# Altium schematic sheet buck_reg_old.SchDoc
size A3; SheetNumber: 2; SheetTotal: 3
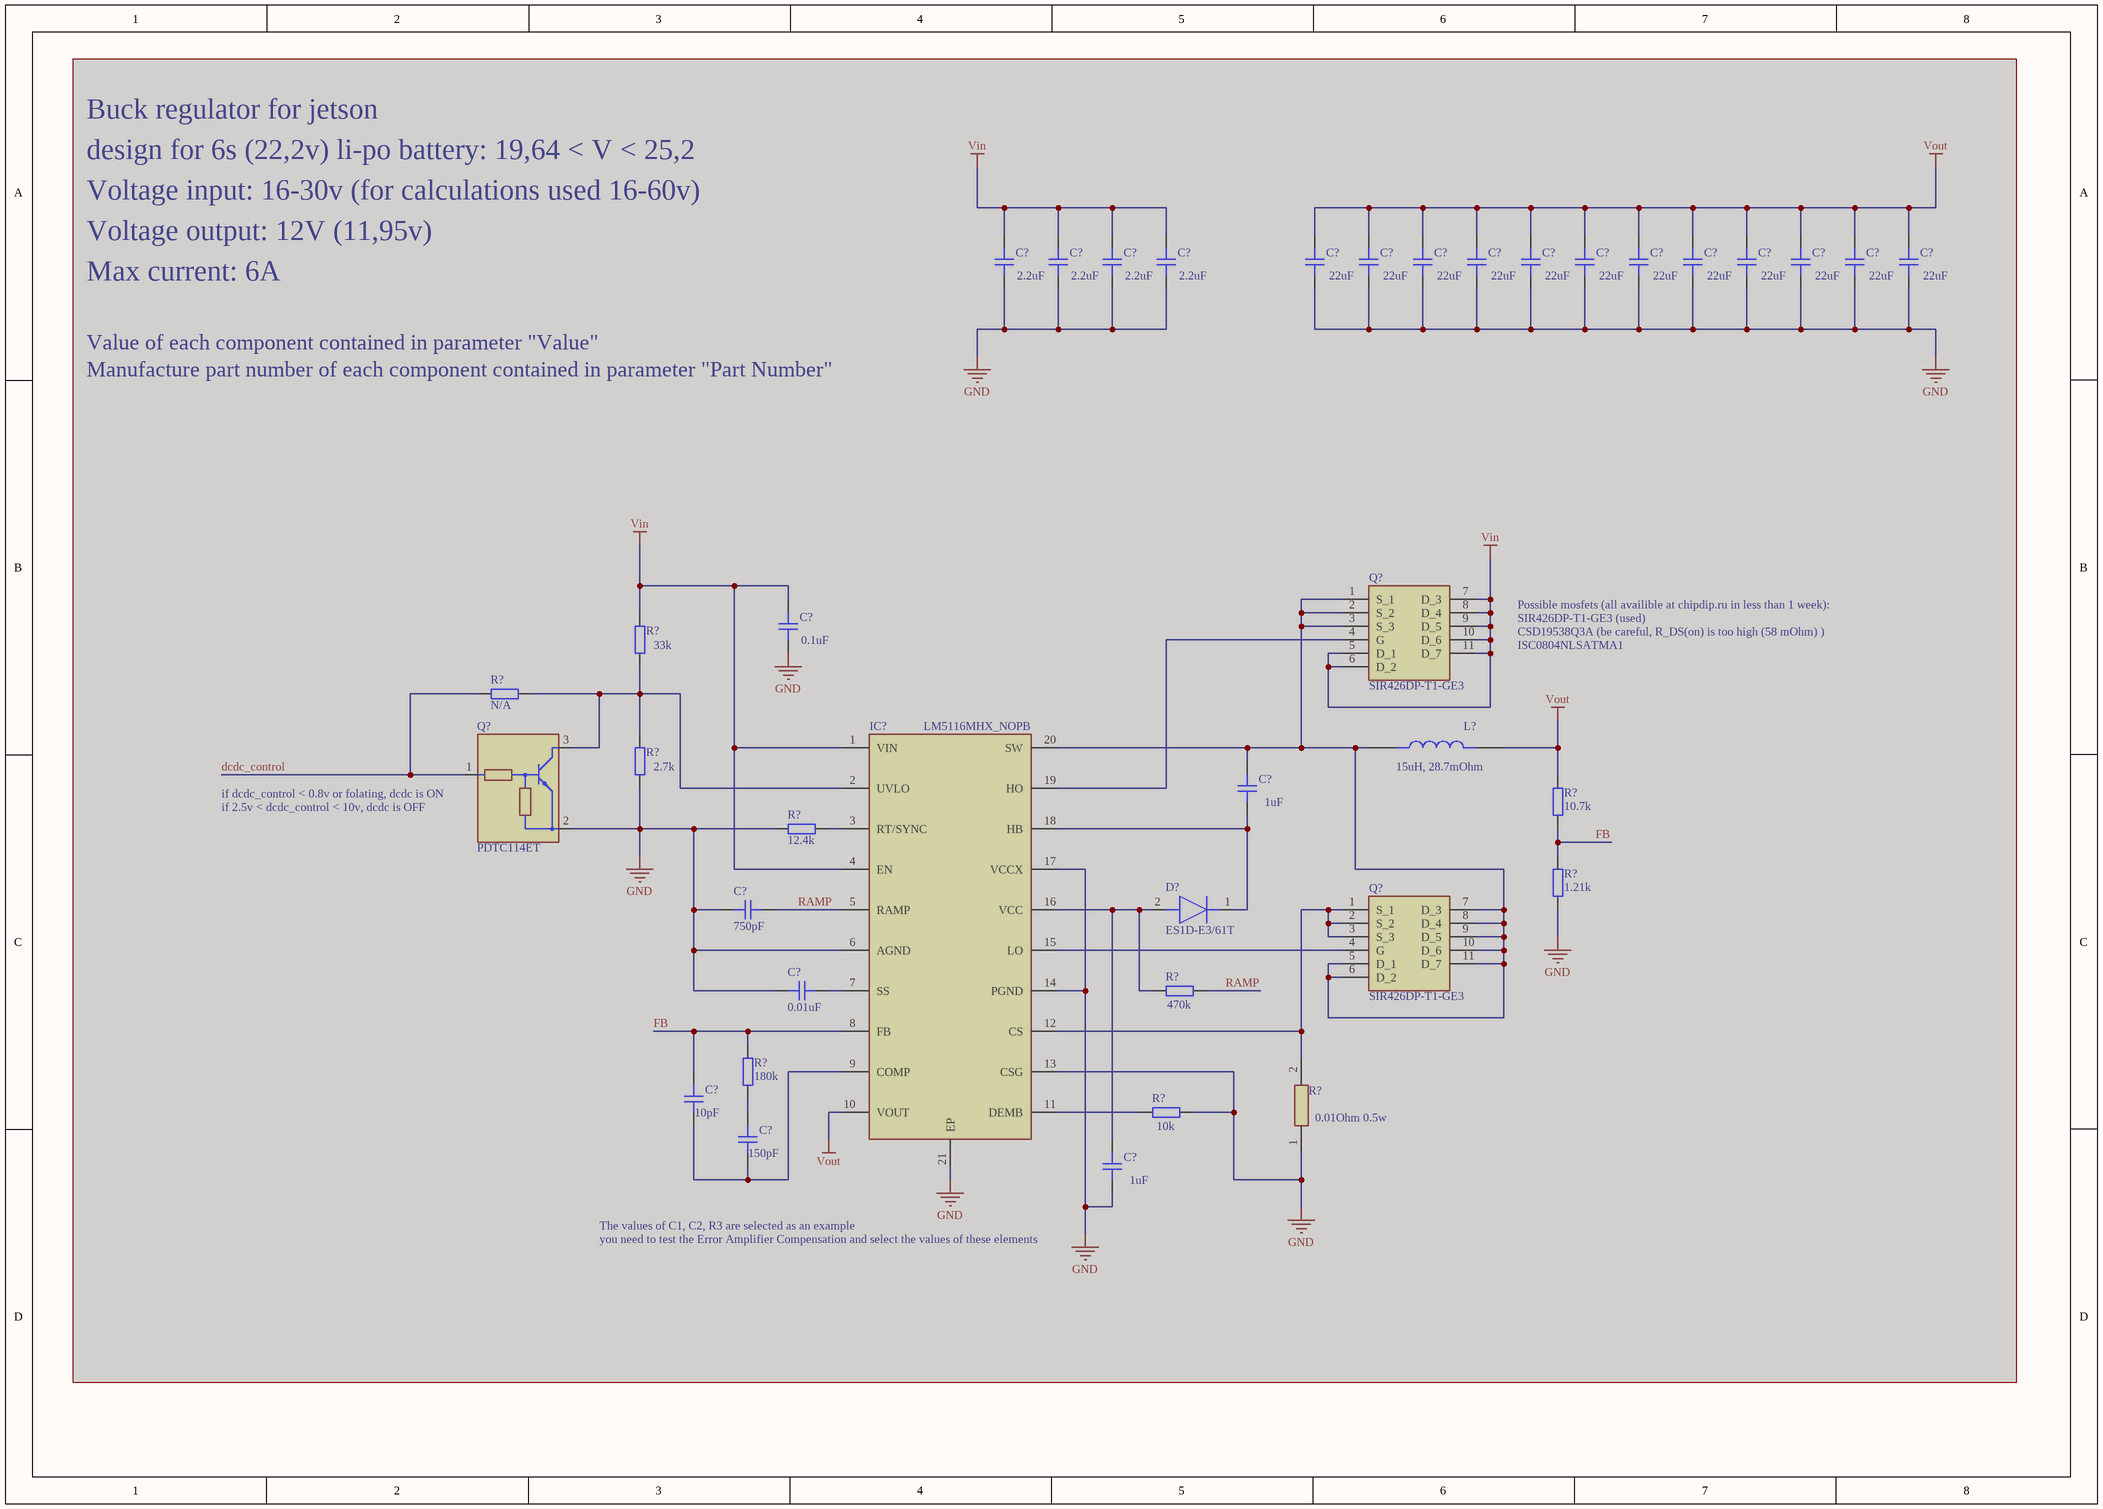
[diagram p0: buck_reg_old.SchDoc]

## Parts
(Parts that share a designator on the sheet are numbered #1, #2 ... from top to bottom, then left to right.)
C?#1  value 2.2uF  [CAP_1206]  (hidden comment: C1206)  (masked out: inside a compile mask, not in the netlist)
C?#2  value 2.2uF  [CAP_1206]  (hidden comment: C1206)  (masked out: inside a compile mask, not in the netlist)
C?#3  value 2.2uF  [CAP_1206]  (hidden comment: C1206)  (masked out: inside a compile mask, not in the netlist)
C?#4  value 2.2uF  [CAP_1206]  (hidden comment: C1206)  (masked out: inside a compile mask, not in the netlist)
C?#5  value 22uF  [CAP_1210]  (hidden comment: C1210)  (masked out: inside a compile mask, not in the netlist)
C?#6  value 22uF  [CAP_1210]  (hidden comment: C1210)  (masked out: inside a compile mask, not in the netlist)
C?#7  value 22uF  [CAP_1210]  (hidden comment: C1210)  (masked out: inside a compile mask, not in the netlist)
C?#8  value 22uF  [CAP_1210]  (hidden comment: C1210)  (masked out: inside a compile mask, not in the netlist)
C?#9  value 22uF  [CAP_1210]  (hidden comment: C1210)  (masked out: inside a compile mask, not in the netlist)
C?#10  value 22uF  [CAP_1210]  (hidden comment: C1210)  (masked out: inside a compile mask, not in the netlist)
C?#11  value 22uF  [CAP_1210]  (hidden comment: C1210)  (masked out: inside a compile mask, not in the netlist)
C?#12  value 22uF  [CAP_1210]  (hidden comment: C1210)  (masked out: inside a compile mask, not in the netlist)
C?#13  value 22uF  [CAP_1210]  (hidden comment: C1210)  (masked out: inside a compile mask, not in the netlist)
C?#14  value 22uF  [CAP_1210]  (hidden comment: C1210)  (masked out: inside a compile mask, not in the netlist)
C?#15  value 22uF  [CAP_1210]  (hidden comment: C1210)  (masked out: inside a compile mask, not in the netlist)
C?#16  value 22uF  [CAP_1210]  (hidden comment: C1210)  (masked out: inside a compile mask, not in the netlist)
C?#17  value 0.1uF  [CAP_0603]  (hidden comment: C0603)  (masked out: inside a compile mask, not in the netlist)
C?#18  value 1uF  [CAP_0603]  (hidden comment: C0603)  (masked out: inside a compile mask, not in the netlist)
C?#19  value 750pF  [CAP_0603]  (hidden comment: C0603)  (masked out: inside a compile mask, not in the netlist)
C?#20  value 0.01uF  [CAP_0603]  (hidden comment: C0603)  (masked out: inside a compile mask, not in the netlist)
C?#21  value 10pF  [CAP_0603]  (hidden comment: C0603)  (masked out: inside a compile mask, not in the netlist)
C?#22  value 150pF  [CAP_0603]  (hidden comment: C0603)  (masked out: inside a compile mask, not in the netlist)
C?#23  value 1uF  [CAP_0603]  (hidden comment: C0603)  (masked out: inside a compile mask, not in the netlist)
D?  Part Number: ES1D-E3/61T  [DIOM5127X229N]  (masked out: inside a compile mask, not in the netlist)
IC?  LM5116MHX_NOPB  [SOP65P640X110-21N]  (masked out: inside a compile mask, not in the netlist)
L?  value 15uH, 28.7mOhm  [IND_SPRH127-560M]  (masked out: inside a compile mask, not in the netlist)
Q?#1  (no value)  [SIR426DPT1GE3]  (masked out: inside a compile mask, not in the netlist)
Q?#2  PDTC114ET  [SOT95P230X110-3N]  (masked out: inside a compile mask, not in the netlist)
Q?#3  (no value)  [SIR426DPT1GE3]  (masked out: inside a compile mask, not in the netlist)
R?#1  value 33k  [RES_0603]  (hidden comment: R0603)  (masked out: inside a compile mask, not in the netlist)
R?#2  R0603  [RES_0603]  (value not drawn)  (masked out: inside a compile mask, not in the netlist)
R?#3  value 2.7k  [RES_0603]  (hidden comment: R0603)  (masked out: inside a compile mask, not in the netlist)
R?#4  value 10.7k  [RES_0402]  (hidden comment: R0402)  (masked out: inside a compile mask, not in the netlist)
R?#5  value 12.4k  [RES_0603]  (hidden comment: R0603)  (masked out: inside a compile mask, not in the netlist)
R?#6  value 1.21k  [RES_0402]  (hidden comment: R0402)  (masked out: inside a compile mask, not in the netlist)
R?#7  value 470k  [RES_0603]  (hidden comment: R0603)  (masked out: inside a compile mask, not in the netlist)
R?#8  value 180k  [RES_0603]  (hidden comment: R0603)  (masked out: inside a compile mask, not in the netlist)
R?#9  value 10k  [RES_0603]  (hidden comment: R0603)  (masked out: inside a compile mask, not in the netlist)
R?#10  value 0.01Ohm 0.5w  [RESC3126X65N]  (masked out: inside a compile mask, not in the netlist)

## Notes on the sheet
- design for 6s (22,2v) li-po battery: 19,64 < V < 25,2
- Buck regulator for jetson
- Voltage input: 16-30v (for calculations used 16-60v)
- Voltage output: 12V (11,95v)
- Max current: 6A
- Value of each component contained in parameter "Value"
- Manufacture part number of each component contained in parameter "Part Number"
- Possible mosfets (all availible at chipdip.ru in less than 1 week):
- CSD19538Q3A (be careful, R_DS(on) is too high (58 mOhm) )
- SIR426DP-T1-GE3 (used)
- ISC0804NLSATMA1
- (near Q?#2) if 2.5v < dcdc_control < 10v, dcdc is OFF
- (near Q?#2) if dcdc_control < 0.8v or folating, dcdc is ON
- The values of C1, C2, R3 are selected as an example
- you need to test the Error Amplifier Compensation and select the values of these elements

## Library data of the parts
C?#1-C?#4 = CAP_1206: Capacitor SMD 1206; Part Number: GRM31CR72A225KA73L; Voltage (V): 100; LCSC: *; Rating: *; Dielectric: *
C?#5-C?#16 = CAP_1210: Capacitor SMD 1210; Part Number: GRM32ER71E226KE15L; Voltage (V): 25; LCSC: *; Rating: *; Dielectric: *
C?#17 = CAP_0603: Capacitor SMD 0603; Part Number: GRM188R72A104KA35D; Voltage (V): 100; LCSC: *; Rating: *; Dielectric: *
C?#18 C?#23 = CAP_0603: Capacitor SMD 0603; Part Number: GRM188R61H105KAALD; Voltage (V): 25; LCSC: *; Rating: *; Dielectric: *
C?#19 = CAP_0603: Capacitor SMD 0603; Part Number: GRM1885C1H751J; Dielecrtic: COG(NP0); LCSC: *; Rating: *; Dielectric: *
C?#20 = CAP_0603: Capacitor SMD 0603; Part Number: GRM188R71H103KA01D; LCSC: *; Rating: *; Dielectric: *
C?#21 = CAP_0603: Capacitor SMD 0603; Part Number: GRM1885C1H100JA01D; Voltage (V): 25; Dielectric: C0G(NP0); LCSC: *; Rating: *
C?#22 = CAP_0603: Capacitor SMD 0603; Part Number: GRM1885C1H151JA01D; Voltage (V): 25; Dielectric: C0G(NP0); LCSC: *; Rating: *
D? = ES1D-E3_61T: Diode; Manufacturer_Name: Vishay
IC? = LM5116MHX_NOPB: Integrated Circuit; Manufacturer_Name: Texas Instruments; Manufacturer_Part_Number: LM5116MHX/NOPB; Part Number: LM5116MHX_NOPB; Height: 1.1mm; Mouser Part Number: 926-LM5116MHX/NOPB; Mouser Price/Stock: https://www.mouser.co.uk/ProductDetail/Texas-Instruments/LM5116MHX-NOPB?qs=QbsRYf82W3EaCl%2FW15P7yA%3D%3D; Arrow Part Number: LM5116MHX/NOPB; Arrow Price/Stock: https://www.arrow.com/en/products/lm5116mhxnopb/texas-instruments?region=nac
L? = SPRH127-560M: MP: SPRH127-150M; Package: None; Price: None; Availability: Unavailable; Part Number: SPRH127-150M
Q?#1 Q?#3 = SIR426DP-T1-GE3: MOSFET (N-Channel); Part Number: SIR426DP-T1-GE3
Q?#2 = PDTC114ET: Transistor RET NPN; Part Number: PDTC114ET,215; Manufacturer_Name: Nexperia; Datasheet Link: https://assets.nexperia.com/documents/data-sheet/PDTC114E_SER.pdf; Manufacturer_Part_Number: PDTC114ET; Mouser Part Number: N/A; Mouser Price/Stock: https://www.mouser.co.uk/ProductDetail/Nexperia/PDTC114ET?qs=vHuUswq2%252BsxH5JWL8htR%2FQ%3D%3D
R?#1 = RES_0603: Resistor SMD 0603; Part Number: RC0603FR-0733KL; Manufacturer Part Number: *; Distributor Link: *; LCSC: *
R?#2 = RES_0603: Resistor SMD 0603; Manufacturer Part Number: *; Distributor Link: *; LCSC: *; Value: N/A
R?#3 = RES_0603: Resistor SMD 0603; Part Number: RC0603JR-072K7L; Manufacturer Part Number: *; Distributor Link: *; LCSC: *
R?#4 R?#6 = RES_0402: Resistor SMD 0402; Part Number: RC0402FR-071K21L; Distributor Link: *; LCSC: *
R?#5 = RES_0603: Resistor SMD 0603; Part Number: RC0603FR-0712K4L; Manufacturer Part Number: *; Distributor Link: *; LCSC: *
R?#7 = RES_0603: Resistor SMD 0603; Part Number: RC0603FR-07470KL; Distributor Link: *; LCSC: *
R?#8 = RES_0603: Resistor SMD 0603; Part Number: RC0603FR-07180KL; Distributor Link: *; LCSC: *
R?#9 = RES_0603: Resistor SMD 0603; Part Number: AC0603FR-0710KL; Distributor Link: *; LCSC: *
R?#10 = RL1210FR-070R1L: Resistor; Part Number: RL1210FR-070R01L; Footprint: 1210